# EAGLE design POGO_CPU (EAGLE 9.6.2)
COMPANY: ADAFRUIT INDUSTRIES; DRAWN: KTOWN; REV: B
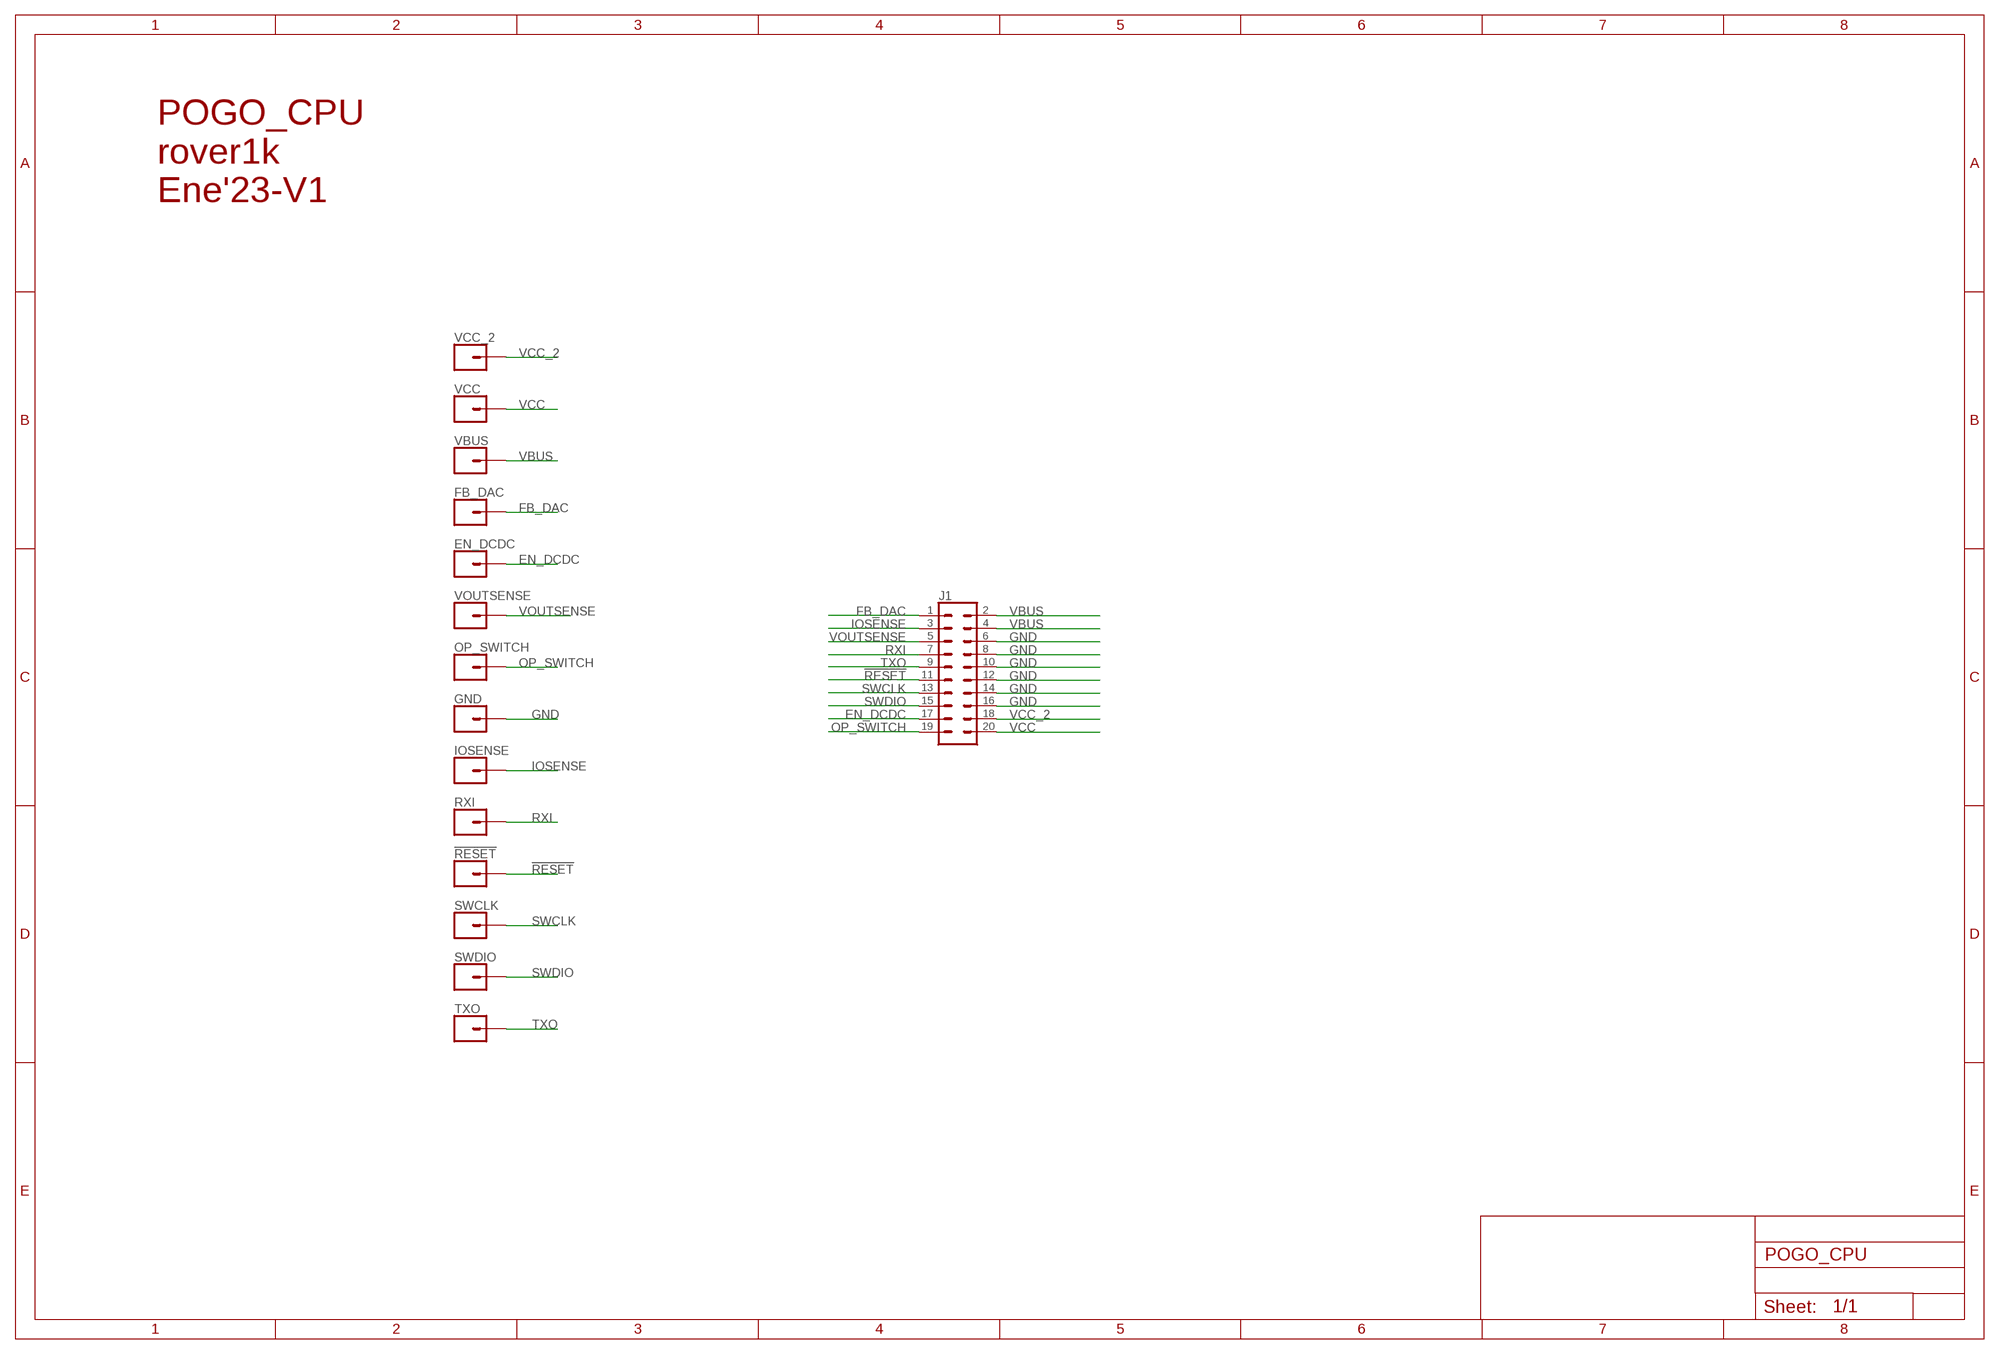
[diagram p0: schematic, sheet 1]

## Parts
!RESET  CONN_01POGOPIN_HOLE_LARGE  [1X01_POGOPIN_HOLE_0.061_DIA]
EN_DCDC  CONN_01POGOPIN_HOLE_LARGE  [1X01_POGOPIN_HOLE_0.061_DIA]
FB_DAC  CONN_01POGOPIN_HOLE_LARGE  [1X01_POGOPIN_HOLE_0.061_DIA]
GND  CONN_01POGOPIN_HOLE_LARGE  [1X01_POGOPIN_HOLE_0.061_DIA]
IOSENSE  CONN_01POGOPIN_HOLE_LARGE  [1X01_POGOPIN_HOLE_0.061_DIA]
J1  CONN_10X2  [2X10]
OP_SWITCH  CONN_01POGOPIN_HOLE_LARGE  [1X01_POGOPIN_HOLE_0.061_DIA]
RXI  CONN_01POGOPIN_HOLE_LARGE  [1X01_POGOPIN_HOLE_0.061_DIA]
SWCLK  CONN_01POGOPIN_HOLE_LARGE  [1X01_POGOPIN_HOLE_0.061_DIA]
SWDIO  CONN_01POGOPIN_HOLE_LARGE  [1X01_POGOPIN_HOLE_0.061_DIA]
TXO  CONN_01POGOPIN_HOLE_LARGE  [1X01_POGOPIN_HOLE_0.061_DIA]
VBUS  CONN_01POGOPIN_HOLE_LARGE  [1X01_POGOPIN_HOLE_0.061_DIA]
VCC  CONN_01POGOPIN_HOLE_LARGE  [1X01_POGOPIN_HOLE_0.061_DIA]
VCC_2  CONN_01POGOPIN_HOLE_LARGE  [1X01_POGOPIN_HOLE_0.061_DIA]
VOUTSENSE  CONN_01POGOPIN_HOLE_LARGE  [1X01_POGOPIN_HOLE_0.061_DIA]

## Nets
!RESET: !RESET.2 J1.11
EN_DCDC: EN_DCDC.2 J1.17
FB_DAC: FB_DAC.2 J1.1
GND: GND.2 J1.6 J1.8 J1.10 J1.12 J1.14 J1.16
IOSENSE: IOSENSE.2 J1.3
OP_SWITCH: J1.19 OP_SWITCH.2
RXI: J1.7 RXI.2
SWCLK: J1.13 SWCLK.2
SWDIO: J1.15 SWDIO.2
TXO: J1.9 TXO.2
VBUS: J1.2 J1.4 VBUS.2
VCC: J1.20 VCC.2
VCC_2: J1.18 VCC_2.2
VOUTSENSE: J1.5 VOUTSENSE.2

## Notes on the sheet
- POGO_CPU
  rover1k
  Ene'23-V1

## Library data of the parts
!RESET EN_DCDC FB_DAC GND IOSENSE OP_SWITCH RXI SWCLK SWDIO TXO VBUS VCC VCC_2 VOUTSENSE = SparkFun-Connectors:CONN_01: Single connection point. Often used as Generic Header-pin footprint for 0.1 inch spaced/style header connections On any of the 0.1 inch spaced packages, you can populate with these: Break Away Headers - Straight <https://www.sparkfun.com/products/116> (PRT-00116) Break Away Male Headers - Right Angle <https://www.sparkfun.com/products/553> (PRT-00553) Female Headers <https://www.sparkfun.com/products/115> (PRT-00115) Break Away Headers - Machine Pin <https://www.sparkfun.com/products/117> (PRT-00117) Break Away Female Headers - Swiss Machine Pin <https://www.sparkfun.com/products/743> (PRT-00743) This device is also useful as a general connection point to wire up your design to another part of your project. Our various solder wires solder well into these plated through hole pads. Hook-Up Wire - Assortment (Stranded, 22 AWG) <https://www.sparkfun.com/products/11375> (PRT-11375) Hook-Up Wire - Assortment (Solid Core, 22 AWG) <https://www.sparkfun.com/products/11367> (PRT-11367) View the entire wire category on our website here <https://www.sparkfun.com/categories/141> Special notes: SMTSO-256-ET is a "flush mount" nut for a 4-40 screw. We mostly use this on specialty testbeds; it is a nice way to connect hardware to your PCB at an adjustable hieght. Also note, the SNAP packages are for using a snappable style connector. We sell a baggie of snaps and they are also used on two LilyPad designs: Snap Assortment - 30 pack (male and female) <https://www.sparkfun.com/products/11347> (DEV-11347) LilyPad Arduino SimpleSnap <https://www.sparkfun.com/products/10941> (DEV-10941) LilyPad SimpleSnap Protoboard <https://www.sparkfun.com/products/10940> (DEV-10940)
J1 = SparkFun-Connectors:CONN_10X2: Multi connection point. Often used as Generic Header-pin footprint for 0.1 inch spaced/style header connections On any of the 0.1 inch spaced packages, you can populate with these: Break Away Headers - Straight <https://www.sparkfun.com/products/116> (PRT-00116) Break Away Male Headers - Right Angle <https://www.sparkfun.com/products/553> (PRT-00553) Female Headers <https://www.sparkfun.com/products/115> (PRT-00115) Break Away Headers - Machine Pin <https://www.sparkfun.com/products/117> (PRT-00117) Break Away Female Headers - Swiss Machine Pin <https://www.sparkfun.com/products/743> (PRT-00743) Special note about the "SPECIAL" package: This was SPECIALLY designed to be used with our Graphic LCD Backpack. Be sure you want to use this! It is not only staggered on each line of header holes, but IT IS ALSO offset of the center point of the top and bottom lines by 5 mil. This causes the headers to lock into place on the "standard" footprint on the LCD screen. The extra squares on the tdocu layer are there simply to reference other pins (if you were to actually populate a longer header than ten long - this is what we do with the backpacks).

## Net classes
2 gnd: width 0.305 mm, drill 0.483 mm, clearance 0.203 mm

## Board
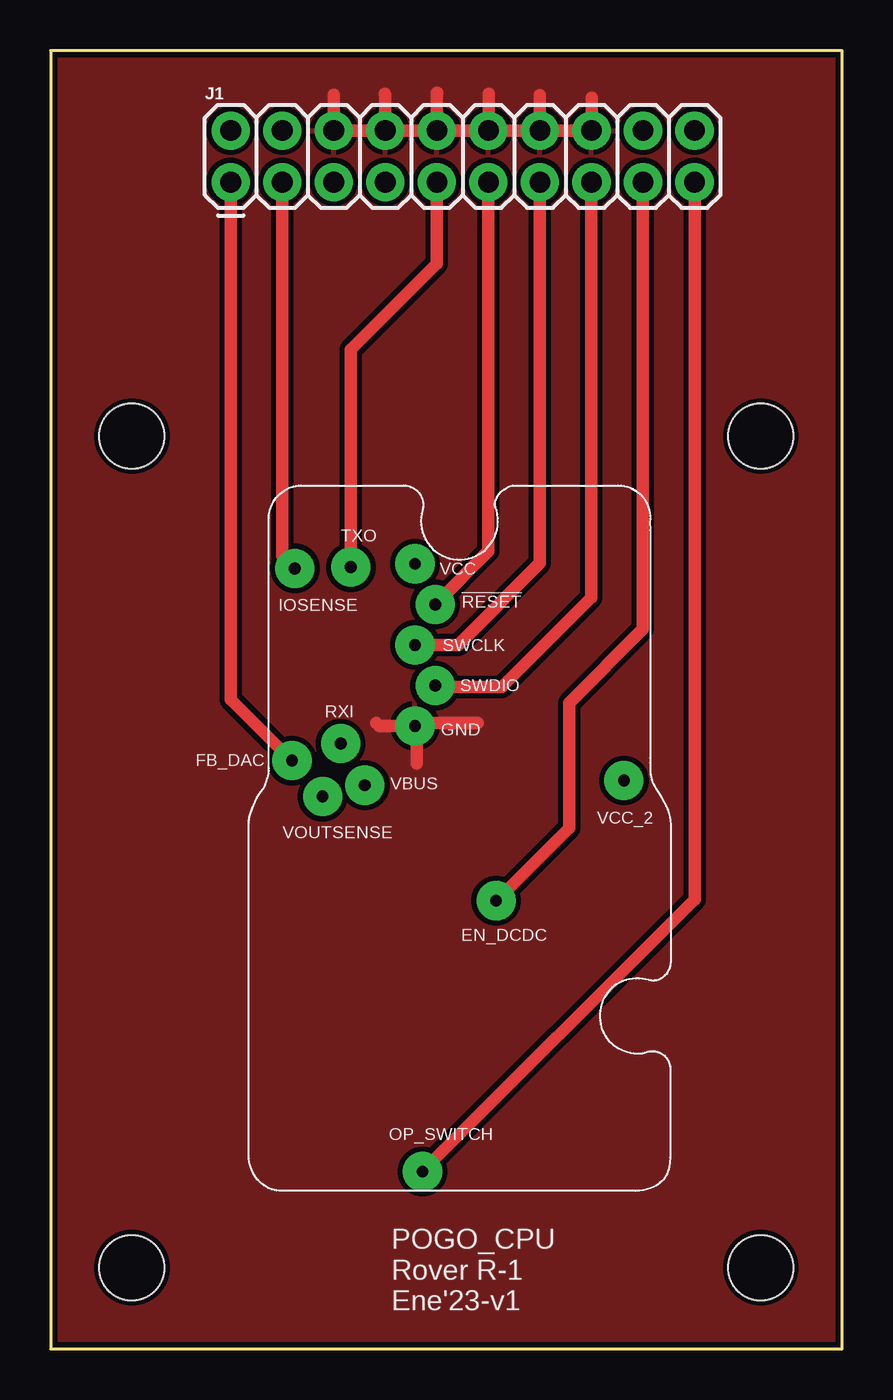
[diagram p1: board, top side]
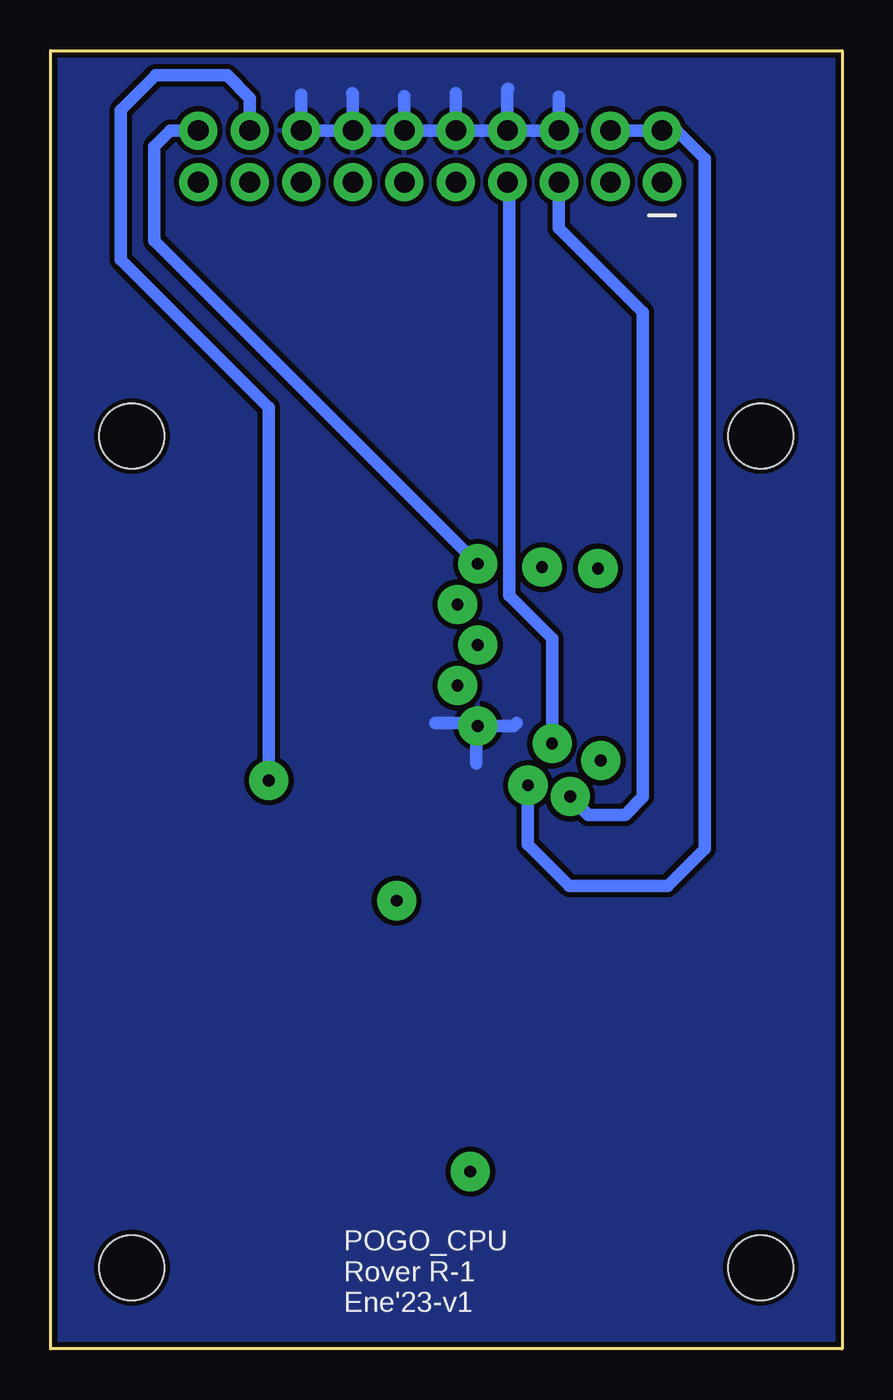
[diagram p2: board, bottom side, seen from below]

Size 39 x 64 mm. Coordinates in mm from the lower left corner, seen from the top.
Outline: 0,64 0,0 39,0 39,64 0,64
Copper layers (1+2*15+16): Top 0.035mm / dielectric 1.5mm / Route2 0.035mm / dielectric 0.15mm / GND 0.035mm / dielectric 0.2mm / Bottom 0.035mm
Design rules "adafruit *": minimum track width 8mil, minimum drill 0.25mm, track to track 8mil, track to pad 8mil, pad to pad 8mil, via to via 8mil, smd to smd 5mil, copper to edge 10mil, drill to drill 8mil, minimum pad ring 10mil, minimum via ring 8mil, stop-mask expansion 2mil, vias tented up to drill 20mil, thermal gap 10mil
Holes 3.2 mm at 35,4 4,4 4,45 35,45

### Footprints (pad centres in the part's own frame; a part is rotated, then mirrored left to right if it is on the bottom)
1X01_POGOPIN_HOLE_0.061_DIA = drill 0.58 pad 1.93: 2 0,0
2X10 = drill 1.016 pad 1.88: 1 0,0; 2 0,2.54; 3 2.54,0; 4 2.54,2.54; 5 5.08,0; 6 5.08,2.54; 7 7.62,0; 8 7.62,2.54; 9 10.16,0; 10 10.16,2.54; 11 12.7,0; 12 12.7,2.54; 13 15.24,0; 14 15.24,2.54; 15 17.78,0; 16 17.78,2.54; 17 20.32,0; 18 20.32,2.54; 19 22.86,0; 20 22.86,2.54

### Placement (x,y rotation side)
!RESET  18.95,36.7 0 bottom
EN_DCDC  21.95,22.09 0 bottom
FB_DAC  11.89,29 0 bottom
GND  17.95,30.71 0 bottom
IOSENSE  12.03,38.47 0 bottom
J1  8.87,57.52 0 top
OP_SWITCH  18.32,8.74 0 bottom
RXI  14.29,29.84 0 bottom
SWCLK  17.95,34.7 0 bottom
SWDIO  18.95,32.7 0 bottom
TXO  14.79,38.54 0 bottom
VBUS  15.48,27.79 0 bottom
VCC  17.95,38.7 0 bottom
VCC_2  28.25,28.02 0 bottom
VOUTSENSE  13.4,27.23 0 bottom

### Tracks (layer width: path | path; a pad name or v marks a point on that pad's centre or on a via)
!RESET
  Top 0.61: !RESET.2 21.57,39.32 J1.11
EN_DCDC
  Top 0.61: EN_DCDC.2 25.55,25.69 25.55,31.84 29.19,35.48 J1.17
FB_DAC
  Top 0.61: FB_DAC.2 8.87,32.02 J1.1
GND
  Top 0.61: GND.2 18.1,30.86 21.04,30.86 | GND.2 18.04,30.62 18.04,28.86 | GND.2 16.19,30.71 16.04,30.86 | 26.66,61.69 J1.16 J1.6 13.95,61.82 13.94,61.83 | J1.14 24.11,61.78 24.09,61.8 | 21.59,61.89 21.59,60.08 J1.12 | J1.10 19.03,61.9 19.06,61.93 | J1.8 16.49,61.84 16.46,61.87
  Bottom 0.61: GND.2 18.04,30.62 18.04,28.86 | GND.2 18.1,30.86 20.04,30.86 | GND.2 16.19,30.71 16.04,30.86 | J1.8 J1.6 13.95,61.74 | J1.8 J1.10 | J1.10 J1.12 | J1.12 J1.14 | J1.14 J1.16 26.66,61.82 | J1.8 16.49,62.09 16.45,62.13 | 19.03,61.91 J1.10 | 21.57,61.76 J1.12 | J1.14 24.11,61.88 24.13,61.9
  pour Top (isolate 0.254): -1.67,65.86 41.04,65.86 41.04,-1.14 -1.67,-1.14
  pour Bottom (isolate 0.254): -1.25,65.86 41.04,65.86 41.04,-1.14 -1.25,-1.14
IOSENSE
  Top 0.61: J1.3 11.41,39.09 IOSENSE.2
OP_SWITCH
  Top 0.61: OP_SWITCH.2 31.73,22.15 J1.19
RXI
  Bottom 0.61: J1.7 16.41,57.44 16.41,37.14 14.29,35.02 RXI.2
SWCLK
  Top 0.61: SWCLK.2 20.08,34.7 24.11,38.73 J1.13
SWDIO
  Top 0.61: J1.15 26.65,37.05 22.24,32.64 19.01,32.64 SWDIO.2
TXO
  Top 0.61: TXO.2 14.79,49.27 19.03,53.51 J1.9
VBUS
  Bottom 0.61: VBUS.2 15.48,24.87 13.44,22.83 8.58,22.83 6.77,24.64 6.77,58.68 8.15,60.06 J1.2 J1.4
VCC
  Bottom 0.61: VCC.2 33.89,54.64 33.89,59.27 33.1,60.06 J1.20
VCC_2
  Bottom 0.61: J1.18 29.19,61.66 30.31,62.78 33.83,62.78 35.54,61.07 35.54,53.69 28.25,46.4 VCC_2.2
VOUTSENSE
  Bottom 0.61: J1.5 13.95,55.24 9.82,51.11 9.82,27.2 10.69,26.33 12.5,26.33 VOUTSENSE.2

### Text on the board
tNames: POGO_CPU / Rover R-1 / Ene'23-v1
bNames: POGO_CPU / Rover R-1 / Ene'23-v1